# EAGLE design BBB_eagle (EAGLE 9.1.3)
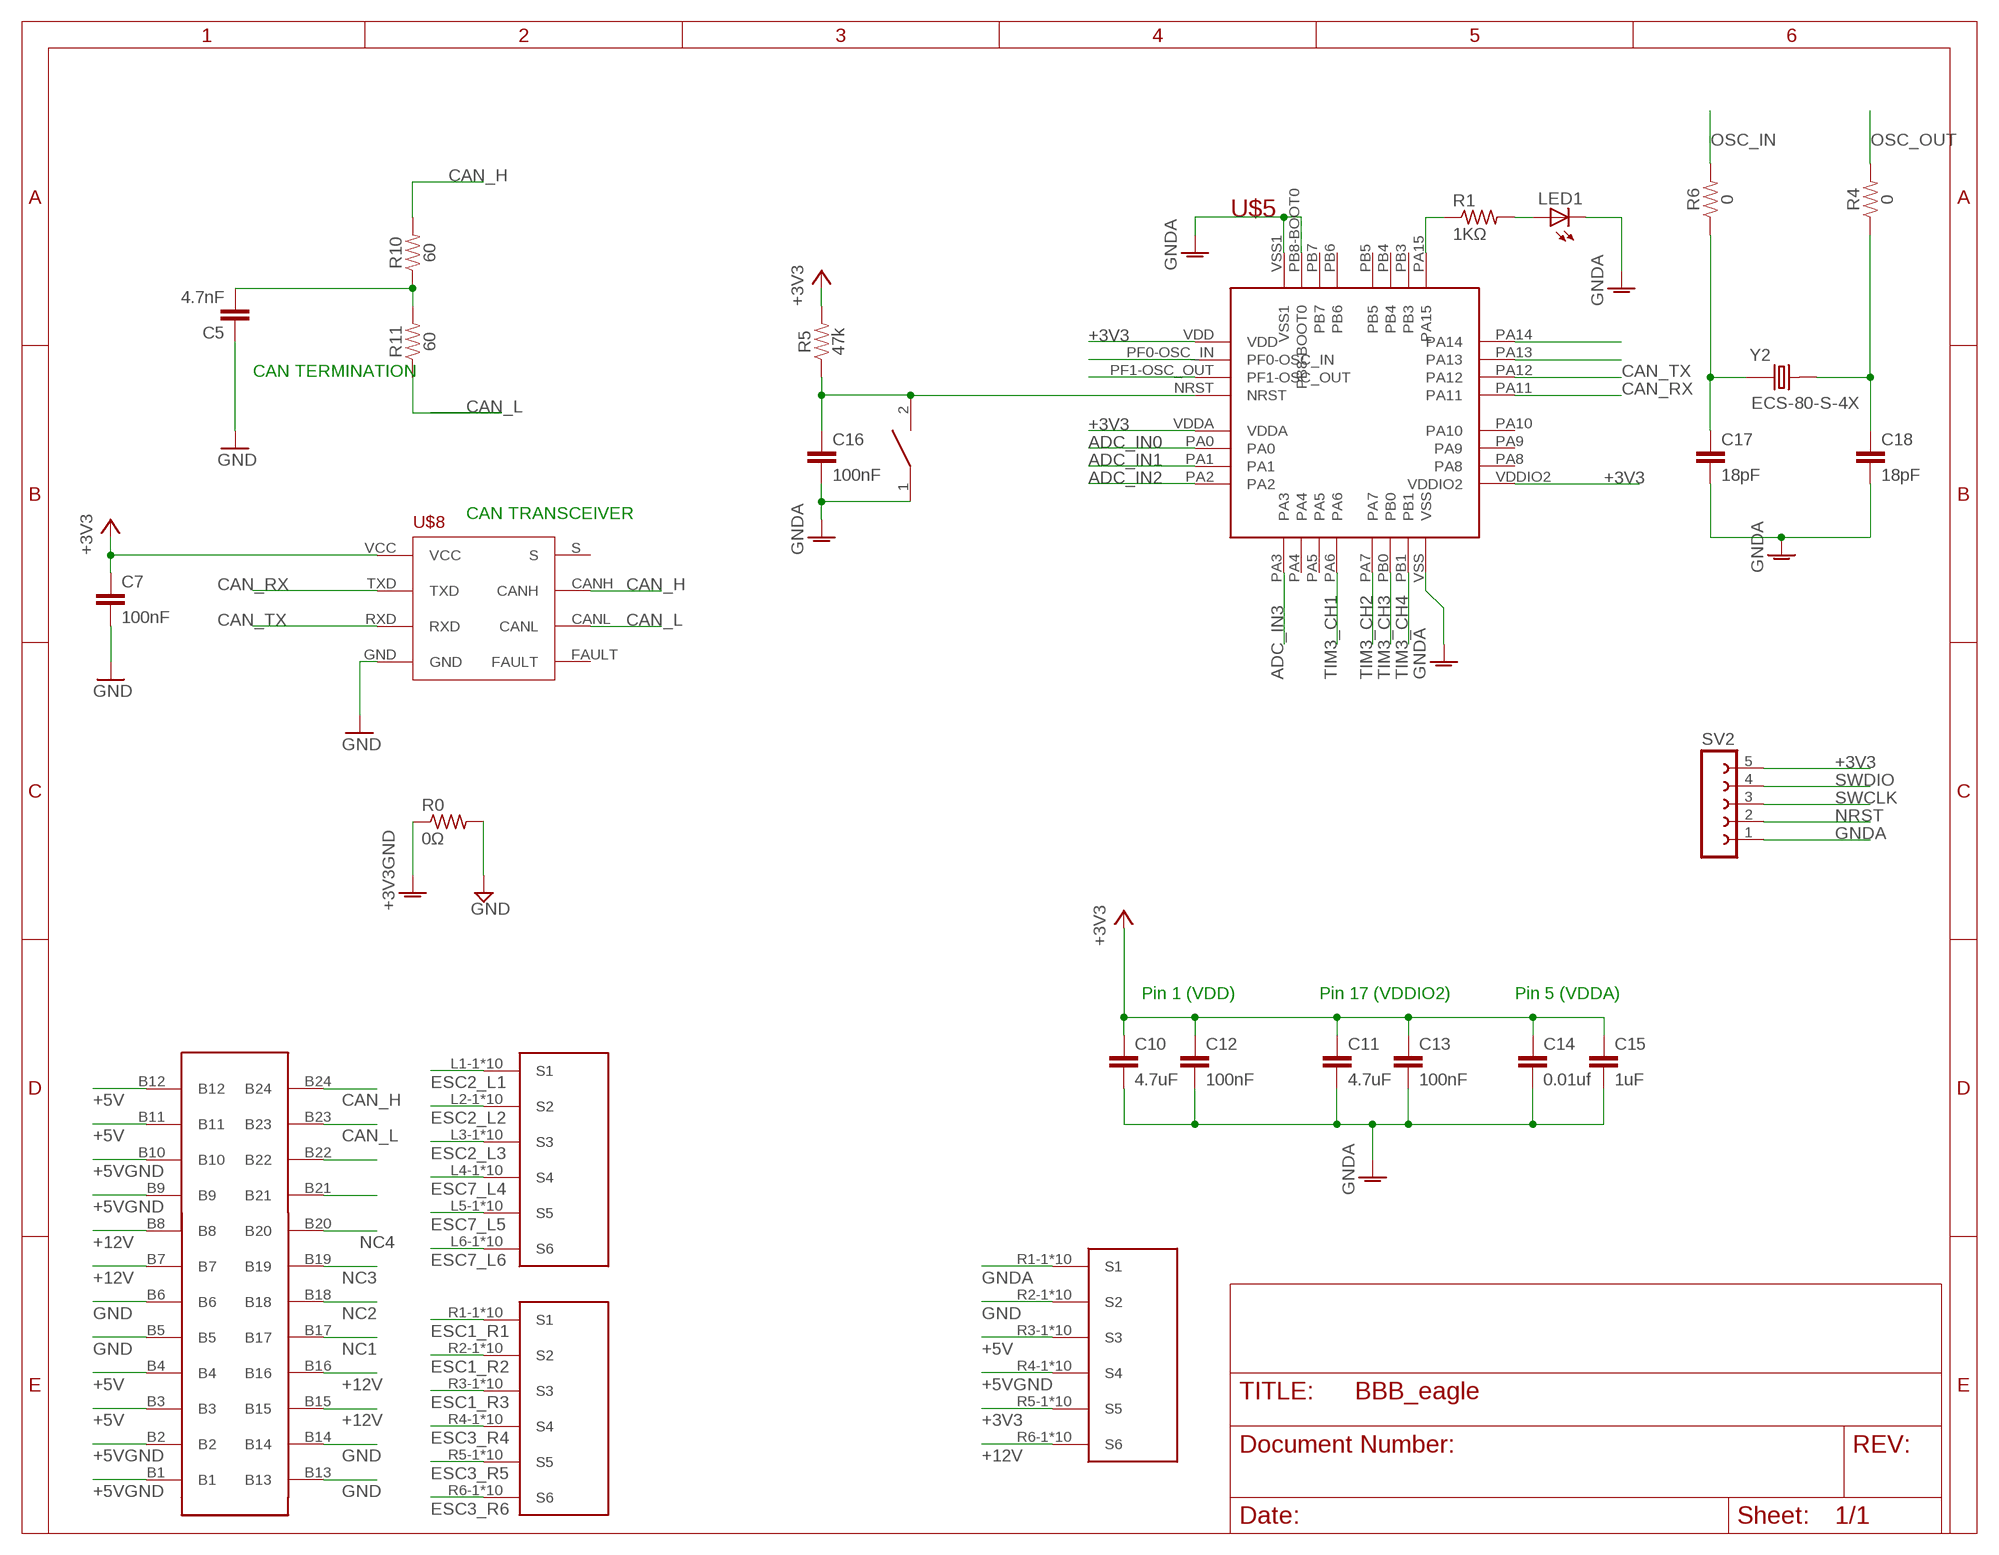
[diagram p0: schematic, sheet 1, part 1 of 2]
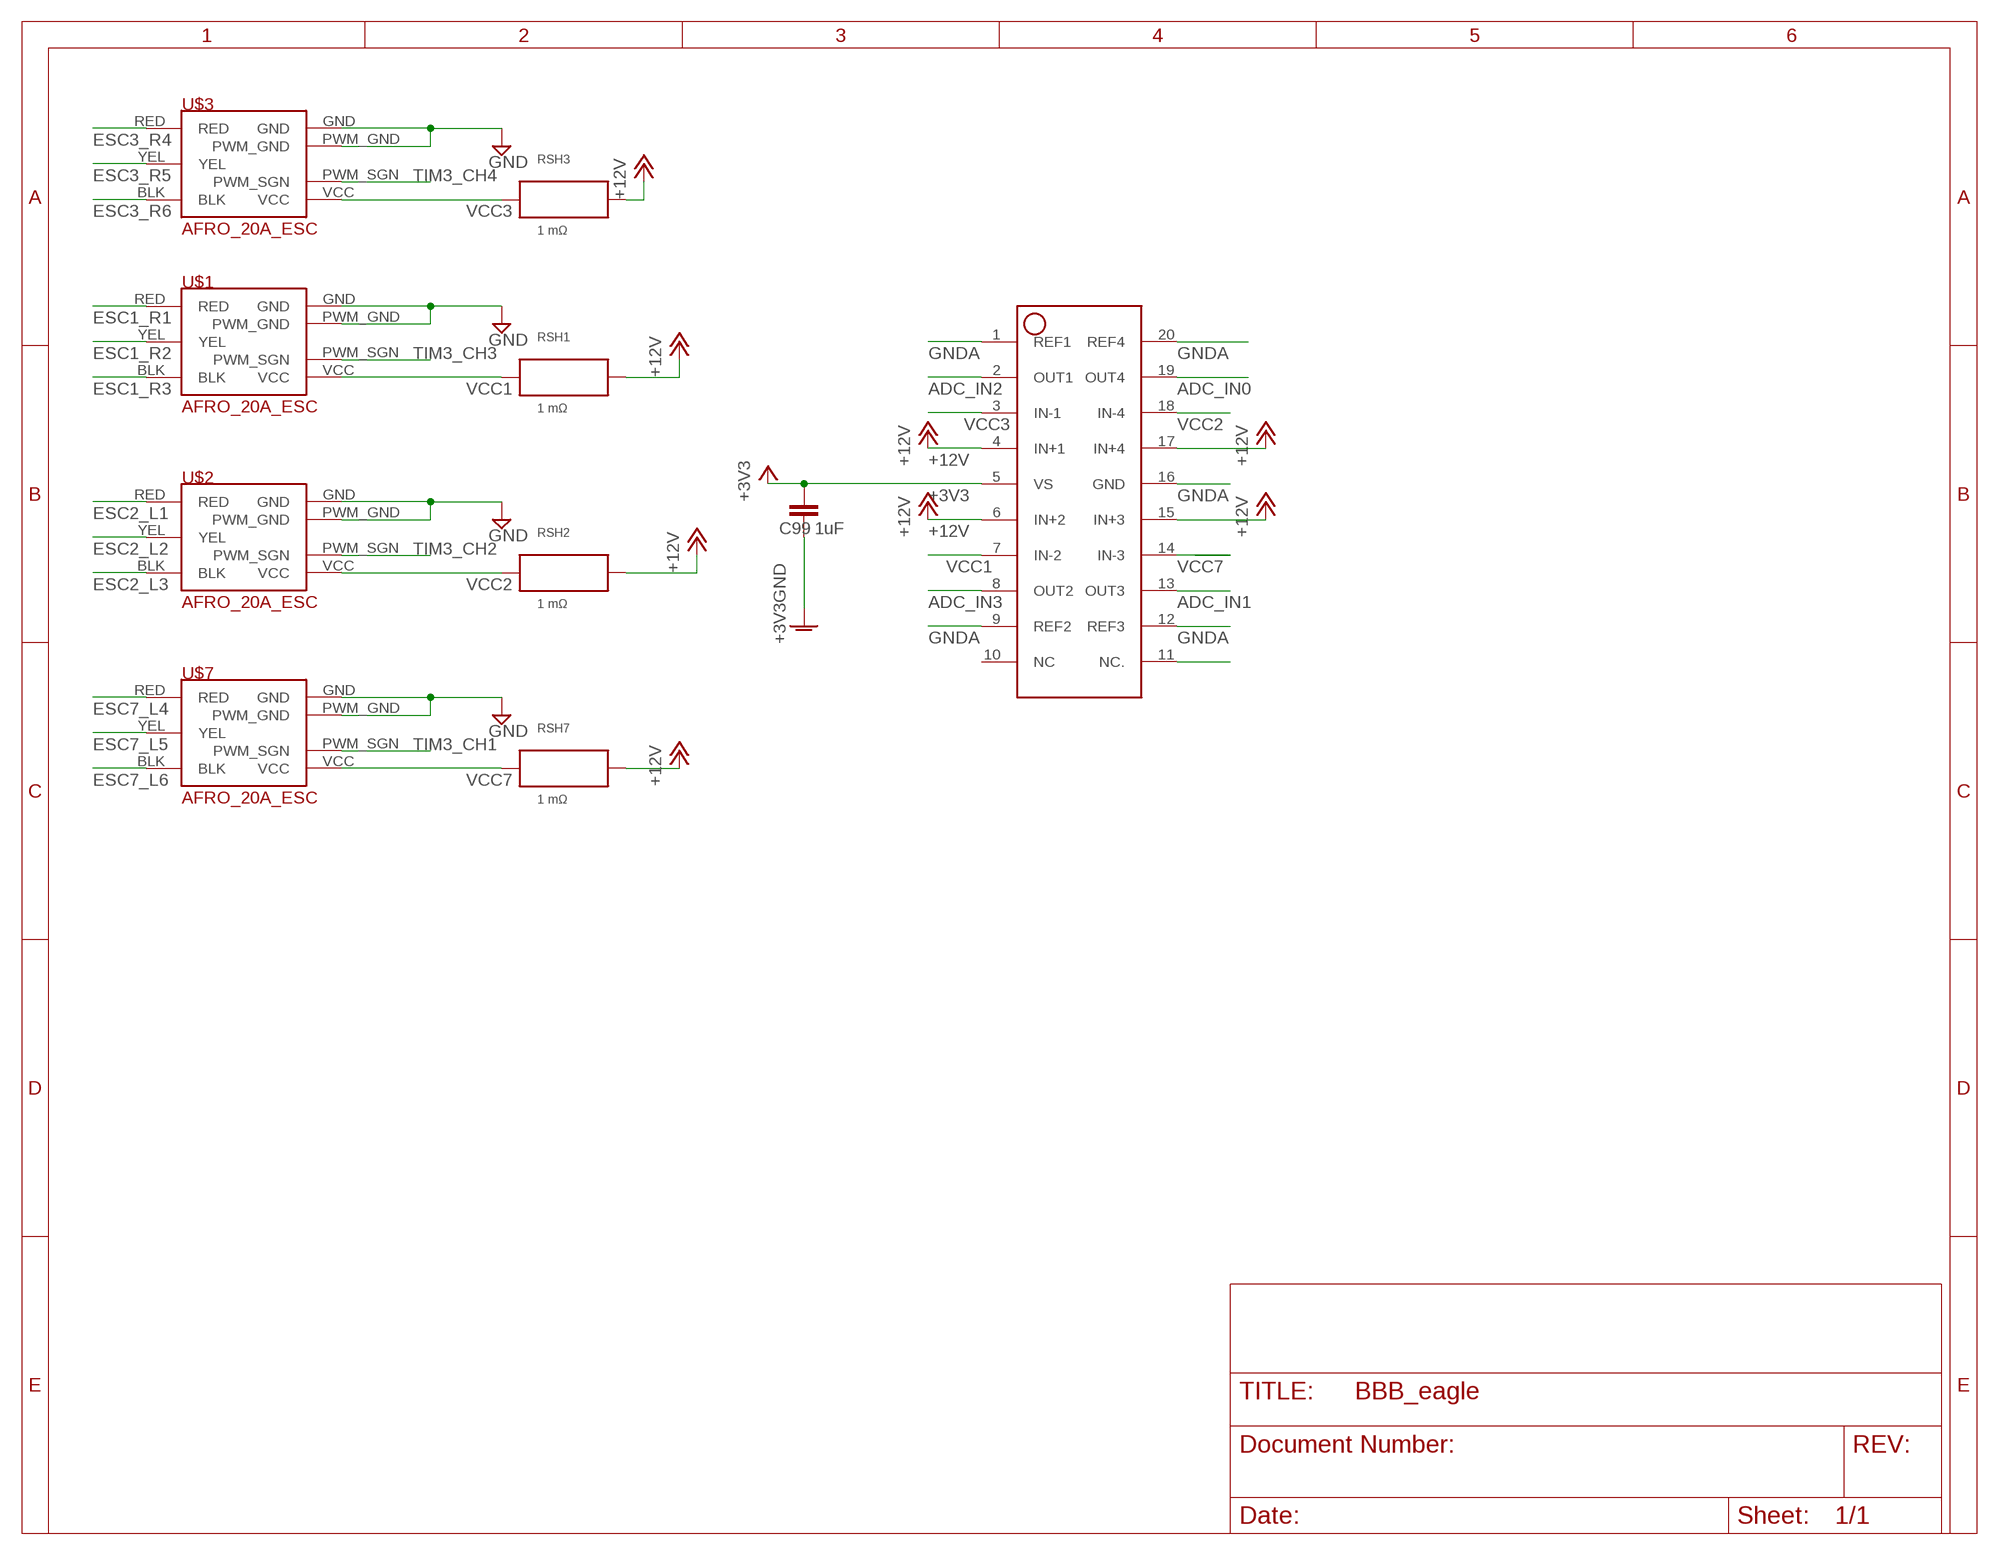
[diagram p1: schematic, sheet 1, part 2 of 2]

## Parts
C5  4.7nF  0.1UF-0603-25V-(+80/-20%)  [0603]
C7  100nF  4.7UF0603  [0603]
C10  4.7uF  4.7UF0603  [0603]
C11  4.7uF  4.7UF0603  [0603]
C12  100nF  4.7UF0603  [0603]
C13  100nF  4.7UF0603  [0603]
C14  0.01uf  4.7UF0603  [0603]
C15  1uF  4.7UF0603  [0603]
C16  100nF  4.7UF0603  [0603]
C17  18pF  4.7UF0603  [0603]
C18  18pF  4.7UF0603  [0603]
C99  1uF  4.7UF0603  [0603]
LED1  LEDCHIP-LED0805  [CHIP-LED0805]
R0  0Ω  R-US_R0603  [R0603]
R1  1KΩ  R-US_R0603  [R0603]
R4  0  1KOHM-0603-1/10W-1%  [0603]
R5  47k  1KOHM-0603-1/10W-1%  [0603]
R6  0  1KOHM-0603-1/10W-1%  [0603]
R10  60  1KOHM-0603-1/10W-1%  [0603]
R11  60  1KOHM-0603-1/10W-1%  [0603]
RESET1  SWITCH  [SW_2512]
RSH1  1 mΩ  CSS2H-2512  [CSS2H-2512]
RSH2  1 mΩ  CSS2H-2512  [CSS2H-2512]
RSH3  1 mΩ  CSS2H-2512  [CSS2H-2512]
RSH7  1 mΩ  CSS2H-2512  [CSS2H-2512]
SV2  FE05-1  [FE05-1]
U$1  AFRO_20A_ESC  [AFRO_20A_ESC]
U$2  AFRO_20A_ESC  [AFRO_20A_ESC]
U$3  AFRO_20A_ESC  [AFRO_20A_ESC]
U$4  ET60T_1  [ET60T_1]
U$5  STM32F042K6T6  [STM32F042K6T6]
U$6  ET60T_2  [ET60T_2]
U$7  AFRO_20A_ESC  [AFRO_20A_ESC]
U$8  TCAN337D  [TCAN337D]
U$14  INA4181A4  [SOP65P640X120-20]
Y2  ECS-80-S-4X  [XTAL_ECS-80-S-4X]

## Nets
+3V3: C7.1 C10.1 C11.1 C12.1 C13.1 C14.1 C15.1 C99.1 R5.2 SV2.5 U$5.VDD U$5.VDDA U$5.VDDIO2 U$6.R5-1(S5) U$6.R5-2(S5) U$6.R5-3(S5) U$6.R5-4(S5) U$6.R5-5(S5) U$6.R5-6(S5) U$6.R5-7(S5) U$6.R5-8(S5) U$6.R5-9(S5) U$6.R5-10(S5) U$8.VCC U$14.5(VS)
+5V: U$4.B3 U$4.B4 U$4.B11 U$4.B12 U$6.R3-1(S3) U$6.R3-2(S3) U$6.R3-3(S3) U$6.R3-4(S3) U$6.R3-5(S3) U$6.R3-6(S3) U$6.R3-7(S3) U$6.R3-8(S3) U$6.R3-9(S3) U$6.R3-10(S3)
+5VGND: U$4.B1 U$4.B2 U$4.B9 U$4.B10 U$6.R4-1(S4) U$6.R4-2(S4) U$6.R4-3(S4) U$6.R4-4(S4) U$6.R4-5(S4) U$6.R4-6(S4) U$6.R4-7(S4) U$6.R4-8(S4) U$6.R4-9(S4) U$6.R4-10(S4)
+12V: RSH1.2 RSH2.2 RSH3.2 RSH7.2 U$4.B7 U$4.B8 U$4.B15 U$4.B16 U$6.R6-1(S6) U$6.R6-2(S6) U$6.R6-3(S6) U$6.R6-4(S6) U$6.R6-5(S6) U$6.R6-6(S6) U$6.R6-7(S6) U$6.R6-8(S6) U$6.R6-9(S6) U$6.R6-10(S6) U$14.4(IN+1) U$14.6(IN+2) U$14.15(IN+3) U$14.17(IN+4)
ADC_IN0: U$5.PA0 U$14.19(OUT4)
ADC_IN1: U$5.PA1 U$14.13(OUT3)
ADC_IN2: U$5.PA2 U$14.2(OUT1)
ADC_IN3: U$5.PA3 U$14.8(OUT2)
CAN_H: R10.2 U$4.B24 U$8.CANH
CAN_L: R11.1 U$4.B23 U$8.CANL
CAN_RX: U$5.PA11 U$8.TXD
CAN_TX: U$5.PA12 U$8.RXD
ESC1_R1: U$1.RED U$4.R1-1(S1) U$4.R1-2(S1) U$4.R1-3(S1) U$4.R1-4(S1) U$4.R1-5(S1) U$4.R1-6(S1) U$4.R1-7(S1) U$4.R1-8(S1) U$4.R1-9(S1) U$4.R1-10(S1)
ESC1_R2: U$1.YEL U$4.R2-1(S2) U$4.R2-2(S2) U$4.R2-3(S2) U$4.R2-4(S2) U$4.R2-5(S2) U$4.R2-6(S2) U$4.R2-7(S2) U$4.R2-8(S2) U$4.R2-9(S2) U$4.R2-10(S2)
ESC1_R3: U$1.BLK U$4.R3-1(S3) U$4.R3-2(S3) U$4.R3-3(S3) U$4.R3-4(S3) U$4.R3-5(S3) U$4.R3-6(S3) U$4.R3-7(S3) U$4.R3-8(S3) U$4.R3-9(S3) U$4.R3-10(S3)
ESC2_L1: U$2.RED U$4.L1-1(S1) U$4.L1-2(S1) U$4.L1-3(S1) U$4.L1-4(S1) U$4.L1-5(S1) U$4.L1-6(S1) U$4.L1-7(S1) U$4.L1-8(S1) U$4.L1-9(S1) U$4.L1-10(S1)
ESC2_L2: U$2.YEL U$4.L2-1(S2) U$4.L2-2(S2) U$4.L2-3(S2) U$4.L2-4(S2) U$4.L2-5(S2) U$4.L2-6(S2) U$4.L2-7(S2) U$4.L2-8(S2) U$4.L2-9(S2) U$4.L2-10(S2)
ESC2_L3: U$2.BLK U$4.L3-1(S3) U$4.L3-2(S3) U$4.L3-3(S3) U$4.L3-4(S3) U$4.L3-5(S3) U$4.L3-6(S3) U$4.L3-7(S3) U$4.L3-8(S3) U$4.L3-9(S3) U$4.L3-10(S3)
ESC3_R4: U$3.RED U$4.R4-1(S4) U$4.R4-2(S4) U$4.R4-3(S4) U$4.R4-4(S4) U$4.R4-5(S4) U$4.R4-6(S4) U$4.R4-7(S4) U$4.R4-8(S4) U$4.R4-9(S4) U$4.R4-10(S4)
ESC3_R5: U$3.YEL U$4.R5-1(S5) U$4.R5-2(S5) U$4.R5-3(S5) U$4.R5-4(S5) U$4.R5-5(S5) U$4.R5-6(S5) U$4.R5-7(S5) U$4.R5-8(S5) U$4.R5-9(S5) U$4.R5-10(S5)
ESC3_R6: U$3.BLK U$4.R6-1(S6) U$4.R6-2(S6) U$4.R6-3(S6) U$4.R6-4(S6) U$4.R6-5(S6) U$4.R6-6(S6) U$4.R6-7(S6) U$4.R6-8(S6) U$4.R6-9(S6) U$4.R6-10(S6)
ESC7_L4: U$4.L4-1(S4) U$4.L4-2(S4) U$4.L4-3(S4) U$4.L4-4(S4) U$4.L4-5(S4) U$4.L4-6(S4) U$4.L4-7(S4) U$4.L4-8(S4) U$4.L4-9(S4) U$4.L4-10(S4) U$7.RED
ESC7_L5: U$4.L5-1(S5) U$4.L5-2(S5) U$4.L5-3(S5) U$4.L5-4(S5) U$4.L5-5(S5) U$4.L5-6(S5) U$4.L5-7(S5) U$4.L5-8(S5) U$4.L5-9(S5) U$4.L5-10(S5) U$7.YEL
ESC7_L6: U$4.L6-1(S6) U$4.L6-2(S6) U$4.L6-3(S6) U$4.L6-4(S6) U$4.L6-5(S6) U$4.L6-6(S6) U$4.L6-7(S6) U$4.L6-8(S6) U$4.L6-9(S6) U$4.L6-10(S6) U$7.BLK
GND: C5.1 C7.2 R0.2 U$1.GND U$1.PWM_GND U$2.GND U$2.PWM_GND U$3.GND U$3.PWM_GND U$4.B5 U$4.B6 U$4.B13 U$4.B14 U$4.B21 U$4.B22 U$6.R2-1(S2) U$6.R2-2(S2) U$6.R2-3(S2) U$6.R2-4(S2) U$6.R2-5(S2) U$6.R2-6(S2) U$6.R2-7(S2) U$6.R2-8(S2) U$6.R2-9(S2) U$6.R2-10(S2) U$7.GND U$7.PWM_GND U$8.GND
GNDA: C10.2 C11.2 C12.2 C13.2 C14.2 C15.2 C16.2 C17.2 C18.2 C99.2 LED1.C R0.1 RESET1.1 SV2.1 U$5.PB8-BOOT0 U$5.VSS U$5.VSS1 U$6.R1-1(S1) U$6.R1-2(S1) U$6.R1-3(S1) U$6.R1-4(S1) U$6.R1-5(S1) U$6.R1-6(S1) U$6.R1-7(S1) U$6.R1-8(S1) U$6.R1-9(S1) U$6.R1-10(S1) U$14.1(REF1) U$14.9(REF2) U$14.12(REF3) U$14.16(GND) U$14.20(REF4) ; supply symbol labelled +3V3GND
N$1: R1.1 U$5.PA15
N$2: LED1.A R1.2
N$3: C18.1 R4.1 Y2.2
N$4: C17.1 R6.1 Y2.1
N$5: C5.2 R10.1 R11.2
N$58: U$14.11(NC.)
NC1: U$4.B17
NC2: U$4.B18
NC3: U$4.B19
NC4: U$4.B20
NRST: C16.1 R5.1 RESET1.2 SV2.2 U$5.NRST
OSC_IN: R6.2 U$5.PF0-OSC_IN
OSC_OUT: R4.2 U$5.PF1-OSC_OUT
SWCLK: SV2.3 U$5.PA14
SWDIO: SV2.4 U$5.PA13
TIM3_CH1: U$5.PA6 U$7.PWM_SGN
TIM3_CH2: U$2.PWM_SGN U$5.PA7
TIM3_CH3: U$1.PWM_SGN U$5.PB0
TIM3_CH4: U$3.PWM_SGN U$5.PB1
VCC1: RSH1.1 U$1.VCC U$14.7(IN-2)
VCC2: RSH2.1 U$2.VCC U$14.18(IN-4)
VCC3: RSH3.1 U$3.VCC U$14.3(IN-1)
VCC7: RSH7.1 U$7.VCC U$14.14(IN-3)
Unconnected: U$5.PA4 U$5.PA5 U$5.PA8 U$5.PA9 U$5.PA10 U$5.PB3 U$5.PB4 U$5.PB5 U$5.PB6 U$5.PB7 U$8.FAULT U$8.S U$14.10(NC)

## Notes on the sheet
- CAN TERMINATION
- CAN TRANSCEIVER
- Pin 1 (VDD) | Pin 17 (VDDIO2) | Pin 5 (VDDA)

## Library data of the parts
C5 = SparkFun-Capacitors:0.1UF: 0.1µF ceramic capacitors A capacitor is a passive two-terminal electrical component used to store electrical energy temporarily in an electric field.; PROD_ID: CAP-00810; VALUE: 0.1uF
C7 C12-C18 C99 = SparkFun-Capacitors:4.7UF: 4.7µF ceramic capacitors A capacitor is a passive two-terminal electrical component used to store electrical energy temporarily in an electric field.; PROD_ID: CAP-08280; VALUE: 4.7uF
C10 C11 = SparkFun-Capacitors:4.7UF: 4.7µF ceramic capacitors A capacitor is a passive two-terminal electrical component used to store electrical energy temporarily in an electric field.; PROD_ID: CAP-08280
LED1 = led:LED: LED OSRAM: - CHIPLED LG R971, LG N971, LY N971, LG Q971, LY Q971, LO R971, LY R971 LH N974, LH R974 LS Q976, LO Q976, LY Q976 LO Q996 - Hyper CHIPLED LW Q18S LB Q993, LB Q99A, LB R99A - SideLED LS A670, LO A670, LY A670, LG A670, LP A670 LB A673, LV A673, LT A673, LW A673 LH A674 LY A675 LS A676, LA A676, LO A676, LY A676, LW A676 LS A679, LY A679, LG A679 - Hyper Micro SIDELED® LS Y876, LA Y876, LO Y876, LY Y876 LT Y87S - SmartLED LW L88C, LW L88S LB L89C, LB L89S, LG L890 LS L89K, LO L89K, LY L89K LS L896, LA L896, LO L896, LY L896 - TOPLED LS T670, LO T670, LY T670, LG T670, LP T670 LSG T670, LSP T670, LSY T670, LOP T670, LYG T670 LG T671, LOG T671, LSG T671 LB T673, LV T673, LT T673, LW T673 LH T674 LS T676, LA T676, LO T676, LY T676, LB T676, LH T676, LSB T676, LW T676 LB T67C, LV T67C, LT T67C, LS T67K, LO T67K, LY T67K, LW E67C LS E67B, LA E67B, LO E67B, LY E67B, LB E67C, LV E67C, LT E67C LW T67C LS T679, LY T679, LG T679 LS T770, LO T770, LY T770, LG T770, LP T770 LB T773, LV T773, LT T773, LW T773 LH T774 LS E675, LA E675, LY E675, LS T675 LS T776, LA T776, LO T776, LY T776, LB T776 LHGB T686 LT T68C, LB T68C - Hyper Mini TOPLED® LB M676 - Mini TOPLED Santana® LG M470 LS M47K, LO M47K, LY M47K Source: http://www.osram.convergy.de LUXEON: - LUMILED® LXK2-PW12-R00, LXK2-PW12-S00, LXK2-PW14-U00, LXK2-PW14-V00 LXK2-PM12-R00, LXK2-PM12-S00, LXK2-PM14-U00 LXK2-PE12-Q00, LXK2-PE12-R00, LXK2-PE12-S00, LXK2-PE14-T00, LXK2-PE14-U00 LXK2-PB12-K00, LXK2-PB12-L00, LXK2-PB12-M00, LXK2-PB14-N00, LXK2-PB14-P00, LXK2-PB14-Q00 LXK2-PR12-L00, LXK2-PR12-M00, LXK2-PR14-Q00, LXK2-PR14-R00 LXK2-PD12-Q00, LXK2-PD12-R00, LXK2-PD12-S00 LXK2-PH12-R00, LXK2-PH12-S00 LXK2-PL12-P00, LXK2-PL12-Q00, LXK2-PL12-R00 Source: www.luxeon.com KINGBRIGHT: KA-3528ASYC Source: www.kingbright.com
R0 R1 = rcl:R-US_: RESISTOR, American symbol; SPICEPREFIX: R
R4-R6 R10 R11 = SparkFun-Resistors:1KOHM: 1kΩ resistor A resistor is a passive two-terminal electrical component that implements electrical resistance as a circuit element. Resistors act to reduce current flow, and, at the same time, act to lower voltage levels within circuits. - Wikipedia; PROD_ID: RES-07856; VALUE: 1k
RESET1 = DiscreteComponents:SWITCH
RSH1-RSH3 RSH7 = INA4181A4:CSS2H-2512
SV2 = con-lsta:FE05-1: FEMALE HEADER; OC_FARNELL: unknown; OC_NEWARK: unknown
U$1-U$3 U$7 = afro_20A_esc:AFRO_20A_ESC
U$4 = ET60T:ET60T_1
U$5 = PI_Shield_Library:STM32F042K6T6
U$6 = ET60T:ET60T_2
U$8 = PI_Shield_Library:TCAN337D
U$14 = INA4181A4:INA4181A4
Y2 = ECS-80-S-4X:ECS-80-S-4X: CRYSTAL T/H; DESCRIPTION: Crystal 8MHz Series 2-Pin HC-49/U; DIGI-KEY_PART_NUMBER: X1057-ND; DIGI-KEY_PURCHASE_URL: https://www.digikey.com/product-detail/en/ecs-inc/ECS-80-S-4X/X1057-ND/827549?utm_source=snapeda&utm_medium=aggregator&utm_campaign=symbol; MF: ECS International; MP: ECS-80-S-4X; PACKAGE: HC-49/US ECS International

## Board
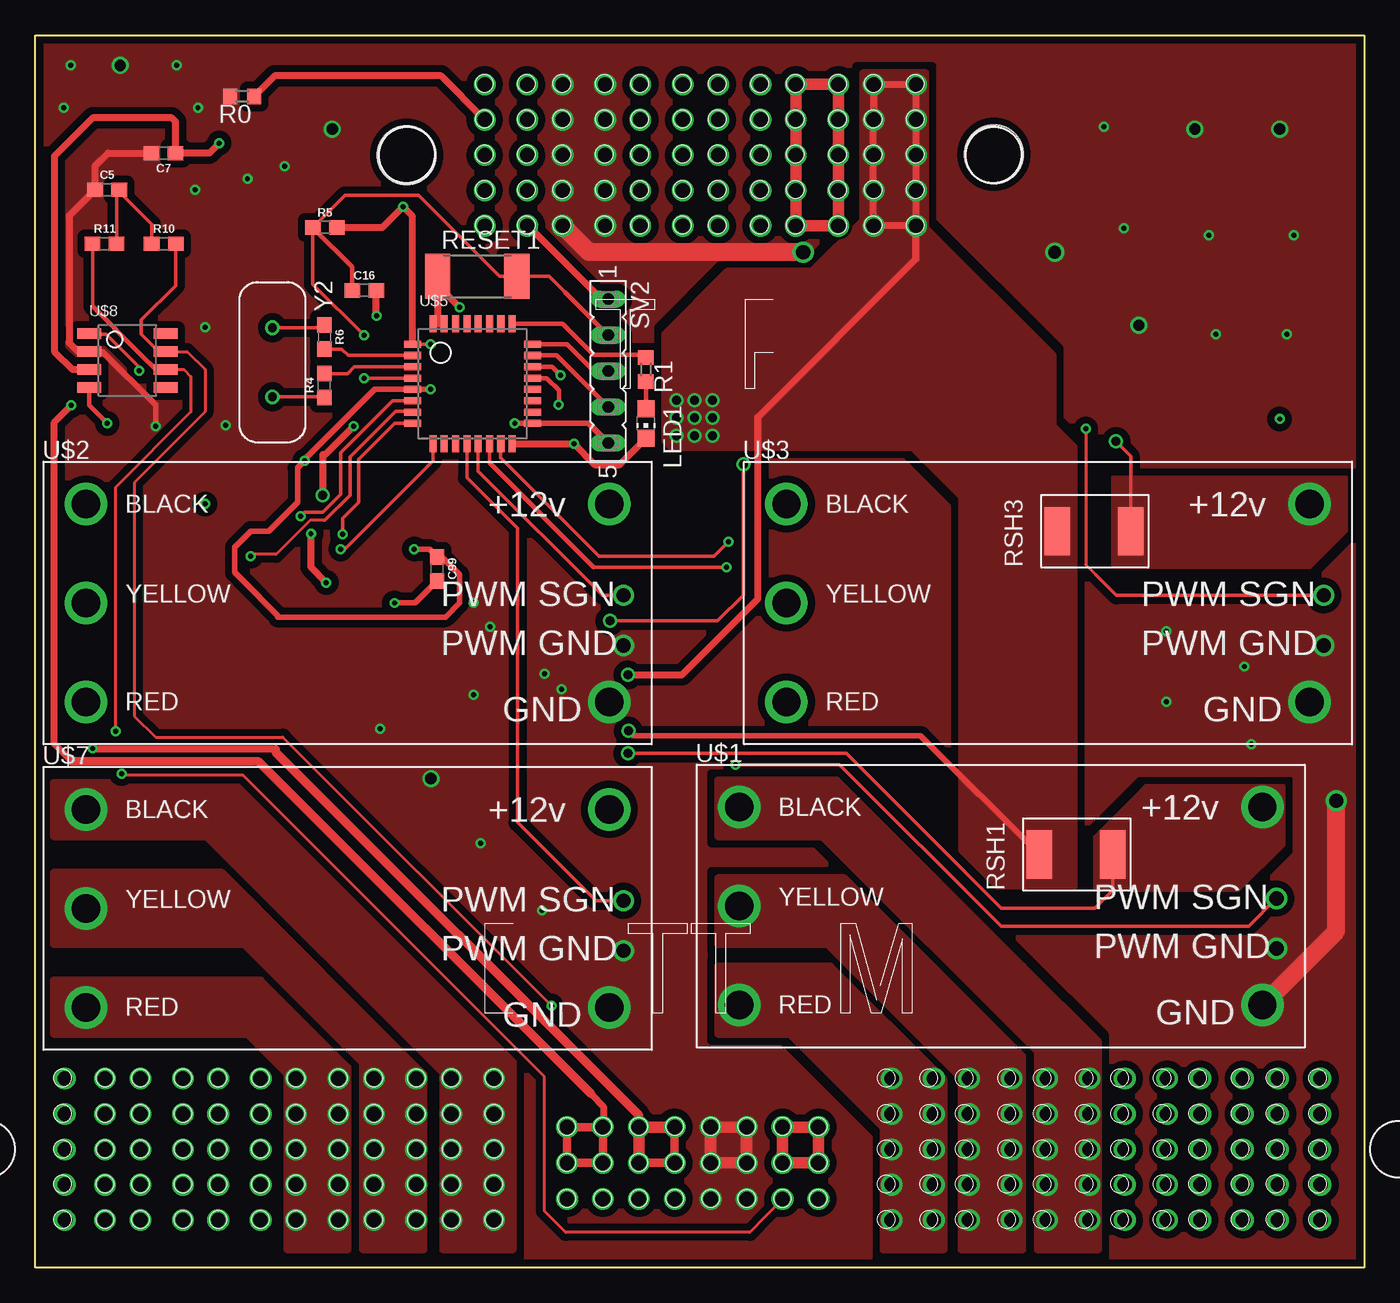
[diagram p2: board, top side]
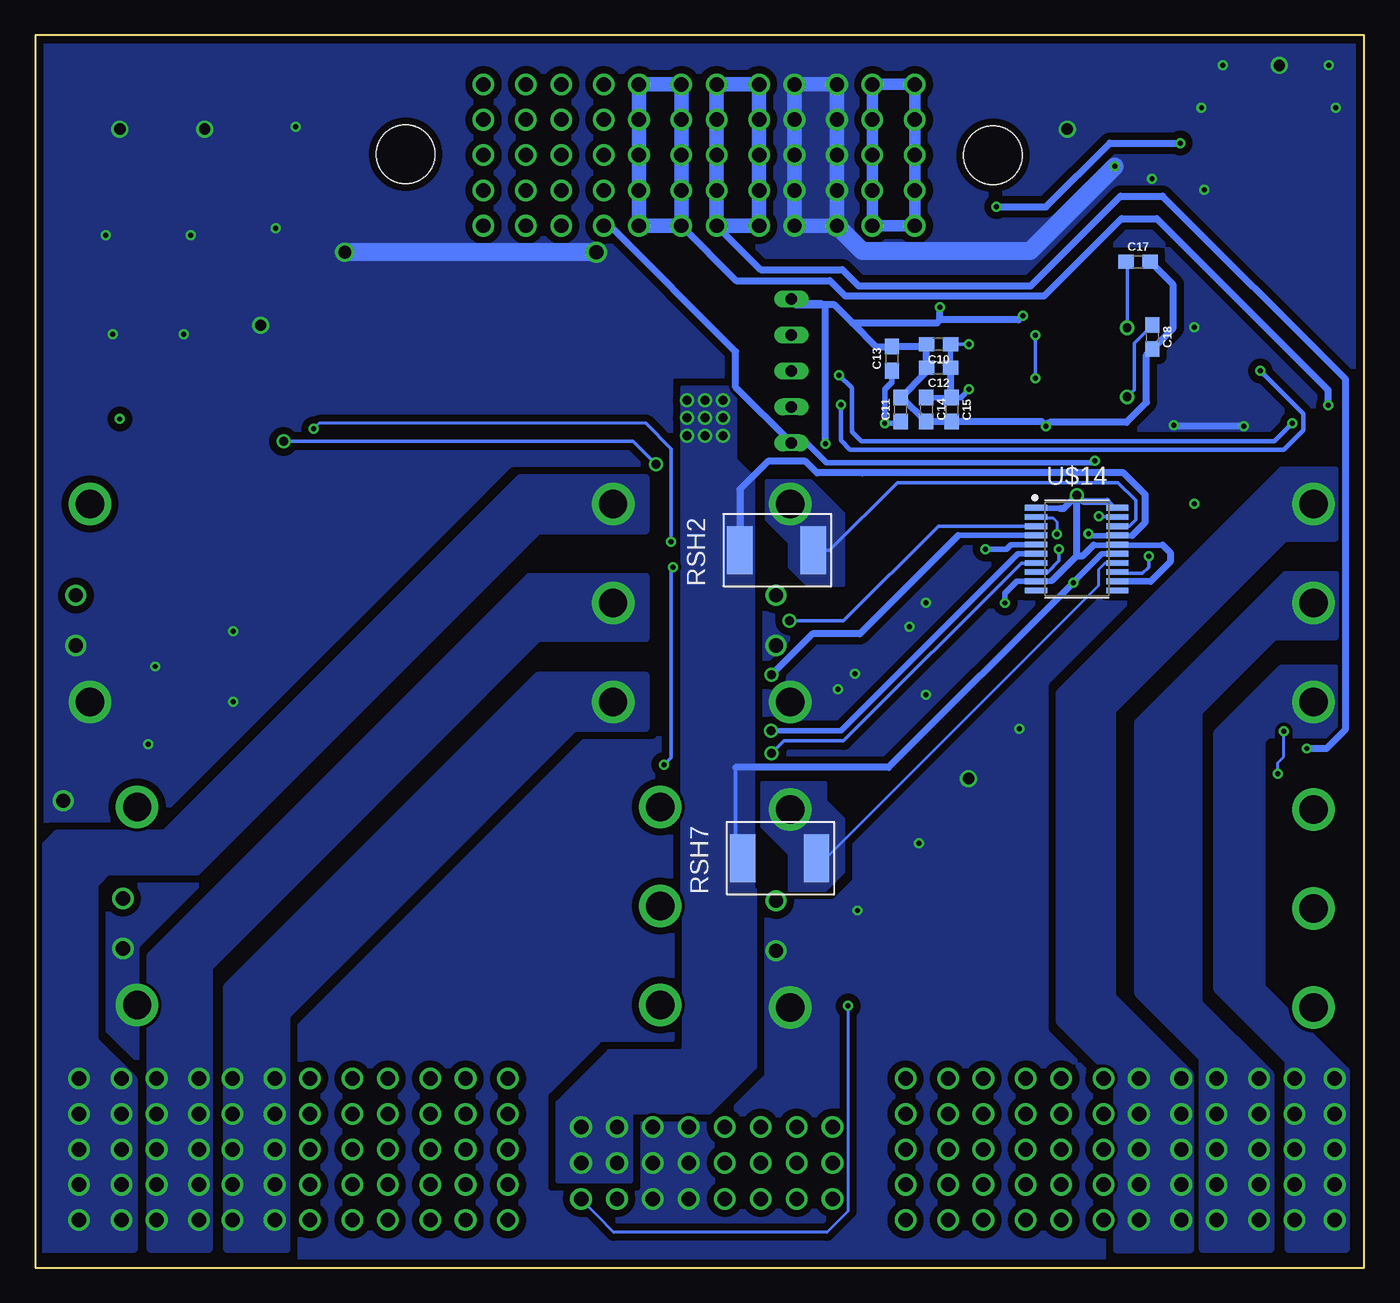
[diagram p3: board, bottom side, seen from below]

Size 93.98 x 87.12 mm. Coordinates in mm from the lower left corner, seen from the top.
Outline: 0,80 0,0
Outline: 0,0 0,87.12 93.98,87.12 93.98,0 0,0
Copper layers (1*16): Top 0.0356mm / dielectric 1.5011mm / Bottom 0.0356mm
Design rules "jason": minimum track width 8mil, minimum drill 13mil, track to track 8mil, track to pad 8mil, pad to pad 6mil, via to via 8mil, smd to smd 6mil, copper to edge 15mil, drill to drill 8mil, minimum pad ring 7mil, minimum via ring 7mil, stop-mask expansion 3mil, vias tented up to drill 0mil, thermal gap 10mil
Holes 4.14 mm at 26.25,78.65 67.8,78.72

### Footprints (pad centres in the part's own frame; a part is rotated, then mirrored left to right if it is on the bottom)
0603 = smd 1.1 x 1: 1 -0.85,0; 2 0.85,0
CHIP-LED0805 = smd 1.2 x 1.2: A 0,-1.05; C 0,1.05
R0603 = smd 1 x 1.1: 1 -0.85,0; 2 0.85,0
SW_2512 = smd 1.8 x 3.2: 1 -2.8,0; 2 2.8,0
CSS2H-2512 = smd 3.4 x 1.8: 1 0,0; 2 0,5.2
FE05-1 = drill 0.813 long: 1 -5.08,0; 2 -2.54,0; 3 0,0; 4 2.54,0; 5 5.08,0
AFRO_20A_ESC = drill 2: BLK -18,7; GND 19,-7; RED -18,-7; VCC 19,7; YEL -18,0 | drill 1: PWM_GND 20,-3; PWM_SGN 20,0.54
ET60T_1 = drill 1.02 pad 1.5: B1 -8.89,2.54; B2 -6.35,2.54; B3 -3.81,2.54; B4 -1.27,2.54; B5 1.27,2.54; B6 3.81,2.54; B7 6.35,2.54; B8 8.89,2.54; B9 -8.89,0; B10 -6.35,0; B11 -3.81,0; B12 -1.27,0; B13 1.27,0; B14 3.81,0; B15 6.35,0; B16 8.89,0; B17 -8.89,-2.54; B18 -6.35,-2.54; B19 -3.81,-2.54; B20 -1.27,-2.54; B21 1.27,-2.54; B22 3.81,-2.54; B23 6.35,-2.54; B24 8.89,-2.54; L1-1 -44.41,5.96; L1-2 -44.41,3.46; L1-3 -44.41,0.96; L1-4 -44.41,-1.54; L1-5 -44.41,-4.04; L1-6 -41.56,5.96; L1-7 -41.56,3.46; L1-8 -41.56,0.96; L1-9 -41.56,-1.54; L1-10 -41.56,-4.04; L2-1 -39.06,5.96; L2-2 -39.06,3.46; L2-3 -39.06,0.96; L2-4 -39.06,-1.54; L2-5 -39.06,-4.04; L2-6 -36.06,5.96; L2-7 -36.06,3.46; L2-8 -36.06,0.96; L2-9 -36.06,-1.54; L2-10 -36.06,-4.04; L3-1 -33.56,5.96; L3-2 -33.56,3.46; L3-3 -33.56,0.96; L3-4 -33.56,-1.54; L3-5 -33.56,-4.04; L3-6 -30.56,5.96; L3-7 -30.56,3.46; L3-8 -30.56,0.96; L3-9 -30.56,-1.54; L3-10 -30.56,-4.04; L4-1 -28.06,5.96; L4-2 -28.06,3.46; L4-3 -28.06,0.96; L4-4 -28.06,-1.54; L4-5 -28.06,-4.04; L4-6 -25.06,5.96; L4-7 -25.06,3.46; L4-8 -25.06,0.96; L4-9 -25.06,-1.54; L4-10 -25.06,-4.04; L5-1 -22.56,5.96; L5-2 -22.56,3.46; L5-3 -22.56,0.96; L5-4 -22.56,-1.54; L5-5 -22.56,-4.04; L5-6 -19.56,5.96; L5-7 -19.56,3.46; L5-8 -19.56,0.96; L5-9 -19.56,-1.54; L5-10 -19.56,-4.04; L6-1 -17.06,5.96; L6-2 -17.06,3.46; L6-3 -17.06,0.96; L6-4 -17.06,-1.54; L6-5 -17.06,-4.04; L6-6 -14.06,5.96; L6-7 -14.06,3.46; L6-8 -14.06,0.96; L6-9 -14.06,-1.54; L6-10 -14.06,-4.04; R1-1 14.06,5.96; R1-2 14.06,3.46; R1-3 14.06,0.96; R1-4 14.06,-1.54; R1-5 14.06,-4.04; R1-6 17.06,5.96; R1-7 17.06,3.46; R1-8 17.06,0.96; R1-9 17.06,-1.54; R1-10 17.06,-4.04; R2-1 19.56,5.96; R2-2 19.56,3.46; R2-3 19.56,0.96; R2-4 19.56,-1.54; R2-5 19.56,-4.04; R2-6 22.56,5.96; R2-7 22.56,3.46; R2-8 22.56,0.96; R2-9 22.56,-1.54; R2-10 22.56,-4.04; R3-1 25.06,5.96; R3-2 25.06,3.46; R3-3 25.06,0.96; R3-4 25.06,-1.54; R3-5 25.06,-4.04; R3-6 28.06,5.96; R3-7 28.06,3.46; R3-8 28.06,0.96; R3-9 28.06,-1.54; R3-10 28.06,-4.04; R4-1 30.56,5.96; R4-2 30.56,3.46; R4-3 30.56,0.96; R4-4 30.56,-1.54; R4-5 30.56,-4.04; R4-6 33.56,5.96; R4-7 33.56,3.46; R4-8 33.56,0.96; R4-9 33.56,-1.54; R4-10 33.56,-4.04; R5-1 35.91,5.96; R5-2 35.91,3.46; R5-3 35.91,0.96; R5-4 35.91,-1.54; R5-5 35.91,-4.04; R5-6 38.91,5.96; R5-7 38.91,3.46; R5-8 38.91,0.96; R5-9 38.91,-1.54; R5-10 38.91,-4.04; R6-1 41.41,5.96; R6-2 41.41,3.46; R6-3 41.41,0.96; R6-4 41.41,-1.54; R6-5 41.41,-4.04; R6-6 44.41,5.96; R6-7 44.41,3.46; R6-8 44.41,0.96; R6-9 44.41,-1.54; R6-10 44.41,-4.04
STM32F042K6T6 = smd 1.2 x 0.5: NRST 0,3.2; PA0 0,1.6; PA1 0,0.8; PA2 0,0; PA8 8.5,0.8; PA9 8.5,1.6; PA10 8.5,2.4; PA11 8.5,3.2; PA12 8.5,4; PA13 8.5,4.8; PA14 8.5,5.6; PF0-OSC_IN 0,4.8; PF1-OSC_OUT 0,4; VDD 0,5.6; VDDA 0,2.4; VDDIO2 8.5,0 | smd 0.5 x 1.2: PA3 1.45,-1.45; PA4 2.25,-1.45; PA5 3.05,-1.45; PA6 3.85,-1.45; PA7 4.65,-1.45; PA15 7.05,7.05; PB0 5.45,-1.45; PB1 6.25,-1.45; PB3 6.25,7.05; PB4 5.45,7.05; PB5 4.65,7.05; PB6 3.85,7.05; PB7 3.05,7.05; PB8-BOOT0 2.25,7.05; VSS 7.05,-1.45; VSS1 1.45,7.05
ET60T_2 = drill 1.02 pad 1.5: R1-1 -15.25,5; R1-2 -15.25,2.5; R1-3 -15.25,0; R1-4 -15.25,-2.5; R1-5 -15.25,-5; R1-6 -12.25,5; R1-7 -12.25,2.5; R1-8 -12.25,0; R1-9 -12.25,-2.5; R1-10 -12.25,-5; R2-1 -9.75,5; R2-2 -9.75,2.5; R2-3 -9.75,0; R2-4 -9.75,-2.5; R2-5 -9.75,-5; R2-6 -6.75,5; R2-7 -6.75,2.5; R2-8 -6.75,0; R2-9 -6.75,-2.5; R2-10 -6.75,-5; R3-1 -4.25,5; R3-2 -4.25,2.5; R3-3 -4.25,0; R3-4 -4.25,-2.5; R3-5 -4.25,-5; R3-6 -1.25,5; R3-7 -1.25,2.5; R3-8 -1.25,0; R3-9 -1.25,-2.5; R3-10 -1.25,-5; R4-1 1.25,5; R4-2 1.25,2.5; R4-3 1.25,0; R4-4 1.25,-2.5; R4-5 1.25,-5; R4-6 4.25,5; R4-7 4.25,2.5; R4-8 4.25,0; R4-9 4.25,-2.5; R4-10 4.25,-5; R5-1 6.75,5; R5-2 6.75,2.5; R5-3 6.75,0; R5-4 6.75,-2.5; R5-5 6.75,-5; R5-6 9.75,5; R5-7 9.75,2.5; R5-8 9.75,0; R5-9 9.75,-2.5; R5-10 9.75,-5; R6-1 12.25,5; R6-2 12.25,2.5; R6-3 12.25,0; R6-4 12.25,-2.5; R6-5 12.25,-5; R6-6 15.25,5; R6-7 15.25,2.5; R6-8 15.25,0; R6-9 15.25,-2.5; R6-10 15.25,-5
TCAN337D = smd 1.7 x 0.75: CANH 5.4,2.54; CANL 5.4,1.27; FAULT 5.4,0; GND 0,2.54; RXD 0,0; S 5.4,3.81; TXD 0,3.81; VCC 0,1.27
SOP65P640X120-20 = smd 1.572 x 0.407: 1 -2.872,2.925; 2 -2.872,2.275; 3 -2.872,1.625; 4 -2.872,0.975; 5 -2.872,0.325; 6 -2.872,-0.325; 7 -2.872,-0.975; 8 -2.872,-1.625; 9 -2.872,-2.275; 10 -2.872,-2.925; 11 2.872,-2.925; 12 2.872,-2.275; 13 2.872,-1.625; 14 2.872,-0.975; 15 2.872,-0.325; 16 2.872,0.325; 17 2.872,0.975; 18 2.872,1.625; 19 2.872,2.275; 20 2.872,2.925
XTAL_ECS-80-S-4X = drill 0.63 pad 1.03: 1 -2.44,0; 2 2.44,0

### Placement (x,y rotation side)
C5  5.08,76.2 0 top
C7  9.07,78.8 180 top
C10  30.1,65.28 180 bottom
C11  32.78,60.66 90 bottom
C12  30.1,63.63 180 bottom
C13  33.4,64.26 90 bottom
C14  30.98,60.66 270 bottom
C15  29.17,60.66 270 bottom
C16  23.26,69.09 0 top
C17  15.99,71.12 0 bottom
C18  14.99,65.79 270 bottom
C99  28.42,49.4 270 top
LED1  43.18,59.69 180 top
R0  14.63,82.81 180 top
R1  43.18,63.5 270 top
R4  20.45,62.36 90 top
R5  20.48,73.53 0 top
R6  20.45,65.79 270 top
R10  9.08,72.39 0 top
R11  4.89,72.39 0 top
RESET1  31.25,70.1 0 top
RSH1  76.2,29.21 90 top
RSH2  38.96,50.73 90 bottom
RSH3  77.47,52.07 90 top
RSH7  38.73,28.96 90 bottom
SV2  40.51,63.39 270 top
U$1  67.78,25.56 0 top
U$2  21.59,46.99 0 top
U$3  71.12,46.99 0 top
U$4  46.49,7.4 0 top
U$5  26.67,59.69 0 top
U$6  47.04,78.66 0 top
U$7  21.59,25.4 0 top
U$8  3.81,62.23 0 top
U$14  20.32,50.8 0 bottom
Y2  16.76,64.01 270 top

### Tracks (layer width: path | path; a pad name or v marks a point on that pad's centre or on a via)
+3V3  (via drill 0.35)
  Top 0.254: v27.94,65.28 27.93,65.29 U$5.VDD | 27.93,62.09 v27.94,62.1
  Top 0.381: U$5.VDDA 23.99,62.09 19.05,57.15 v19.05,57.05 18.55,56.55 18.55,54.11 16.51,52.07 15.24,52.07 14.1,50.93 14.1,49.15 14.62,48.62 17.14,46.1 17.14,45.97 26.92,45.97 | C99.1 27.87,50.8
  Top 0.406: U$5.VDDA 27.93,62.09 | v33.91,59.69 U$5.VDDIO2 39.12,59.69 SV2.5 | 26.92,45.97 26.95,46 29,46 30,47 30,49 28.75,50.25 C99.1 | 27.87,50.8 v26.8,50.8
  Top 0.5: 26.67,72.39 26.67,74.33 v26,75 24.53,73.53 R5.2 | v13,79.5 12.3,78.8 C7.1
  Top 0.508: C7.1 9.92,81.02 9.66,81.28 4.04,81.28 1.35,78.59 1.35,64.77 2.62,63.5 U$8.VCC | U$5.VDD 26.67,72.39
  Top 0.813: U$6.R5-1 U$6.R5-2 U$6.R5-3 U$6.R5-4 U$6.R5-5 U$6.R5-10 U$6.R5-9 U$6.R5-8 U$6.R5-7 U$6.R5-6 U$6.R5-1
  Bottom 0.254: C10.1 v27.94,65.28 | C11.1 32.9,59.69
  Bottom 0.406: C10.1 C12.1 | v27.94,62.1 28.54,61.51 C15.1 C14.1 | C13.1 33.4,62.61 33.91,62.1 v33.91,59.69 32.9,59.69 | SV2.5 39.43,58.31 38.04,56.92 32,56.92 19.18,56.92 v19.05,57.05 | U$14.5 24.99,51.12 25.32,50.8 v26.8,50.8
  Bottom 0.5: v26,75 22.5,75 18,79.5 v13,79.5
  Bottom 0.508: C12.1 29.25,61.58 C15.1 | SV2.5 44.45,62.25 44.45,64.77 53.34,73.66 U$6.R5-5
+5V  (via drill 0.35)
  Top 0.508: 17,36.65 4.12,36.65 v4.06,36.7
  Top 0.61: U$4.B11 U$4.B12 U$4.B4 | U$4.B3 42.68,10.77 17,36.45 17,36.65
  Top 0.813: U$4.B11 U$4.B3 U$4.B4
  Bottom 0.5: 1.35,38.02 2.67,36.7 v4.06,36.7
  Bottom 0.508: 1.35,38.02 1.35,62.85 14.26,75.76 17.24,75.76 23.58,69.42 35.76,69.42 36.9,70.56 42.69,70.56 U$6.R3-10
  Bottom 1.016: U$6.R3-5 U$6.R3-10 U$6.R3-9 U$6.R3-8 U$6.R3-7 U$6.R3-6 U$6.R3-1 U$6.R3-2 U$6.R3-3 U$6.R3-4 U$6.R3-5
+5VGND  (via drill 0.35)
  Top 0.5: 40.18,11.39 U$4.B2
  Top 0.508: 2.54,35.81 2.54,35.84 1.35,37.04 1.35,59.77 v2.54,60.96 | 39.28,12.29 40.18,11.39
  Top 0.61: 39.28,12.29 15.76,35.81 2.54,35.81 | U$4.B2 U$4.B10 U$4.B9 U$4.B1 U$4.B2
  Bottom 0.508: v2.54,60.96 2.54,62.04 14.67,74.17 17.17,74.17 22.63,68.71 36.71,68.71 37.79,69.79 44.42,69.79 | U$6.R4-5 44.42,69.79 | 44.42,69.79
  Bottom 1.016: U$6.R4-5 U$6.R4-10 U$6.R4-9 U$6.R4-8 U$6.R4-7 U$6.R4-6 U$6.R4-1 U$6.R4-2 U$6.R4-3 U$6.R4-4 U$6.R4-5
+12V  (via drill 0.35, 0.64)
  Top 0.406: RSH1.2 62.61,37.6 42.29,37.6 v41.95,37.95
  Top 0.5: v20.57,48.44 19.49,49.52 v19.49,51.88
  Top 0.508: v41.91,41.91 45.72,41.91 51.1,47.29 51.1,60.12 62.29,71.32 U$6.R6-10 | U$6.R6-10 U$6.R6-5 U$6.R6-4 U$6.R6-3 U$6.R6-2 U$6.R6-1 U$6.R6-6 U$6.R6-7 U$6.R6-8 U$6.R6-9 U$6.R6-10
  Top 0.813: U$4.B7 U$4.B15 U$4.B16 U$4.B8 U$4.B7
  Bottom 0.254: 17.46,50.46 U$14.15 | 44.45,35.37 44.45,29.47 RSH7.2 | U$14.6 | U$14.17 17.43,51.76
  Bottom 0.406: 16.42,51.76 17.43,51.76 19.37,51.76 | U$14.6 24.48,50.47 37.01,37.95 v41.95,37.95 | U$14.4 28.7,51.77 | 20.57,48.45 18.56,50.46 17.46,50.46
  Bottom 0.5: 16.42,51.76 15.48,52.7 15.48,54.65 17.02,56.2 35.5,56.2 | 44.45,35.37 33.64,35.37 v20.57,48.44 20.57,48.45 | 43.18,56 42.18,57 39.5,57 38.7,56.2 | v19.49,51.88 19.37,51.76
  Bottom 0.508: 28.7,51.77 35.66,44.81 39.01,44.81 v41.91,41.91 | 35.5,56.2 38.7,56.2 | 43.18,56 44.16,55.02 RSH2.2
  other vias: 45.34,61.34 46.61,61.34 47.88,61.34 47.88,60.07 46.61,60.07 45.34,60.07 45.34,58.8 46.61,58.8 47.88,58.8
  pour Bottom (no thermals): 44.45,62.23 48.26,62.23 48.26,25.4 43.18,25.4 43.18,55.88 44.45,57.15
  pour Bottom (no thermals): 56.95,6.18 56.95,11.63 53.34,15.24 52.07,15.24 48.26,15.24 47.99,15.51 47.99,26.67 43.18,26.67 43.18,16.51 43.18,14.2 46.34,11.04 51.94,11.04 51.94,6.18
  pour Top (no thermals): 58.5,84.47 58.5,74.02 54.9,70.43 52.93,70.43 48.93,70.43 44.5,66 44.5,58.5 45,58 48.5,58 62,58 65.5,54.5 65.5,29.5 68,27 73.5,27 73.5,58 72,59.5 72,64.5 63,73.5 63,84.47
ADC_IN0  (via drill 0.35)
  Top 0.254: v18.77,53.14 19.03,53.4 20.3,53.4 21.59,54.69 21.59,57.62 25.26,61.29 U$5.PA0
  Bottom 0.254: U$14.19 18.7,53.08 v18.77,53.14
ADC_IN1  (via drill 0.35)
  Top 0.203: 15.36,50.42 17.02,50.42 19.43,52.83 20.46,52.83
  Top 0.254: 15.36,50.42 v15.24,50.3 | 20.46,52.83 22.25,54.62 22.25,57.32 25.47,60.54 26.62,60.54 U$5.PA1
  Bottom 0.254: v15.24,50.3 15.24,49.53 15.67,49.1 17.37,49.1 U$14.13
ADC_IN2  (via drill 0.35)
  Top 0.254: U$5.PA2 25.4,59.69 24.13,58.42 | 24.13,58.42 | 24.13,58.42 22.86,57.15 22.86,54.11 21.73,52.98 v21.73,51.86
  Bottom 0.203: U$14.2 23.12,53 22,53 21.73,52.73 v21.73,51.86
ADC_IN3  (via drill 0.35)
  Top 0.254: U$5.PA3 28.12,57.04 21.88,50.8 v21.59,50.8
  Bottom 0.254: v21.59,50.8 21.59,49.97 22.38,49.17 U$14.8
CAN_H  (via drill 0.35)
  Top 0.203: U$8.CANH 10.73,64.77 12,63.5 12,60.5 7,55.5 7,39 8.5,37.5 17.5,37.5 v36.5,18.5
  Top 0.254: U$8.CANH 8.73,64.77 7.5,66 7.5,67 9.93,69.43 R10.2
  Bottom 0.203: U$4.B24 53.08,2.5 38,2.5 36.5,4 36.5,17 v36.5,18.5
CAN_L  (via drill 0.35)
  Top 0.203: 8.5,63.5 U$8.CANL 10.5,63.5 11,63 11,60.5 5.68,55.18 v5.68,37.93 | U$4.B23 50.53,2.5 37.5,2.5 36,4 36,13.5 14.7,34.8 6.1,34.8 v6.1,34.92
  Top 0.254: 4.04,67.96 R11.1
  Top 0.305: 8.5,63.5 7.5,64.5 4.04,67.96
  Bottom 0.203: v6.1,34.92 6.1,35.71 5.68,36.12 v5.68,37.93
CAN_RX  (via drill 0.35)
  Top 0.254: U$8.TXD 3.85,66 5,66 7.34,63.66 v7.34,63.4
  Top 0.305: U$5.PA11 36.17,62.89 37.04,62.02 37.04,61.04 v37,61
  Bottom 0.305: v7.34,63.4 4.31,60.36 4.31,59.19 5.67,57.83 36.35,57.83 37.01,58.49 37.01,60.99 v37,61
CAN_TX  (via drill 0.35)
  Top 0.305: U$5.PA12 36.55,63.69 v37.13,63.1 | v5.08,59.69 3.81,60.96 U$8.RXD
  Bottom 0.305: 35.57,58.43 36.22,59.08 36.22,62.19 v37.13,63.1 | 35.57,58.43 35.56,58.42 | v5.08,59.69 6.35,58.42 35.56,58.42 | 35.56,58.42 35.57,58.43
ESC1_R1
  pour Top (no thermals): 48.26,21.32 48.26,16.51 52.07,16.51 53.34,16.51 59.94,9.91 59.94,1.27 64.29,1.27 64.29,13.27 56.24,21.32
ESC1_R2
  pour Top (no thermals): 48.26,27.56 48.26,26.67 48.26,22.86 55.98,22.86 65.44,13.39 65.44,1.27 69.85,1.27 69.85,14.93 57.22,27.56
ESC1_R3
  pour Top (no thermals): 48.26,34.46 48.26,30.48 55.62,30.48 70.85,15.25 70.85,13.21 70.85,1.27 75.2,1.27 75.2,15.97 69.85,21.32 56.71,34.46
ESC2_L1
  pour Bottom (isolate 0.254, no thermals): 2.04,40.64 2.04,37.63 6.82,37.63 7.24,37.21 7.24,19.9 3.85,16.51 1.31,13.97 1.27,13.97 1.27,1.27 5.35,1.27 5.35,14.59 10.41,19.65 10.41,37.85 5.85,42.41 2.04,42.41
ESC2_L2
  pour Bottom (no thermals): 6.62,1.27 11.43,1.27 11.43,14.76 16,19.34 16,38.61 5.57,49.04 2.04,49.04 2.04,44.59 6.34,44.59 11.7,39.23 11.7,35.56 11.7,18.78 6.62,13.7
ESC2_L3
  pour Bottom (no thermals): 12.27,1.27 12.27,13.67 17.78,19.18 17.78,39.37 16.51,40.64 5.58,51.57 3.81,51.57 2.04,51.57 2.04,56.38 5.85,56.38 21.59,40.64 21.59,38.1 21.59,17.4 17.53,13.34 17.53,1.27
ESC3_R4
  pour Bottom (no thermals): 50.8,41.91 50.8,38.1 55.88,38.1 76.2,17.78 76.2,6.35 76.2,1.27 80.43,1.27 80.43,19.9 58.42,41.91
ESC3_R5
  pour Bottom (no thermals): 50.8,48.9 50.8,44.45 58.42,44.45 81.7,21.17 81.7,16.93 81.7,1.27 85.85,1.27 85.85,15.75 85.85,22.1 59.05,48.9
ESC3_R6
  pour Bottom (no thermals): 50.8,55.88 50.8,52.07 58.42,52.07 82.55,27.94 87.63,27.94 88.9,27.94 89.79,27.05 89.79,16.13 87.01,13.35 87.01,12.08 87.01,1.27 93.47,1.27 93.47,29.72 92.71,30.48 92.46,30.73 84.84,30.73 59.69,55.88
ESC7_L4
  pour Top (isolate 0.254, no thermals): 1.27,20.32 1.27,16.51 11.43,16.51 14.97,16.51 17.78,13.7 17.78,1.27 22.13,1.27 22.13,14.13 15.94,20.32
ESC7_L5
  pour Top (no thermals): 1.27,27.94 1.27,22.86 12.7,22.86 14.73,22.86 23.12,14.47 23.12,1.27 27.5,1.27 27.5,13.65 13.21,27.94
ESC7_L6
  pour Top (isolate 0.508, no thermals): 1.27,34.29 1.27,30.48 12.09,30.48 28.79,13.78 28.79,1.27 33.82,1.27 33.82,14.57 14.1,34.29
GND  (via drill 0.35, 0.8 pad 1.15, 0.9 pad 1.2, 1 pad 1.3)
  Top 0.406: U$8.GND 4.73,64.77 8.5,61 v8.5,59.5
  Top 0.508: U$8.GND 3.02,64.77 2.39,65.41 2.39,74.36 C5.1 4.23,77.89 5.14,78.8 C7.2
  Top 0.813: U$4.B14 U$4.B13 U$4.B5 U$4.B6 U$4.B14
  Top 1.27: U$1.GND 92,23.78 v92,33 | U$6.R2-5 39.14,71.81 54.29,71.81 v54.31,71.79
  Bottom 0.508: v8.5,59.5 13.4,59.5 v13.46,59.56
  Bottom 1.016: U$6.R2-5 U$6.R2-4 U$6.R2-3 U$6.R2-2 U$6.R2-1 U$6.R2-6 U$6.R2-7 U$6.R2-8 U$6.R2-9 U$6.R2-10 U$6.R2-5
  Bottom 1.27: U$6.R2-5 35.51,71.88 23.62,71.88 v17.64,77.86 | v54.31,71.79 v72.09,71.79
  other vias: 12,66.5 31,40.5 21,80.5 6,85 11.3,76.2 10,85 77,73.5 83.5,66 78.05,66.62 82,80.5 83,73 85.5,42.5 88,80.5 27.98,34.58 35.84,25.25 31.5,30 88.5,66 24.39,38.11 2.5,85 11.5,82 80,45 80,40 86,37 32.15,45.32 37.21,40.89 2,82 15,77 89,73 75.56,80.64 36,42 31,47
  pour Top (isolate 0.508, rank 2, no thermals): -0.81,87.06 -0.81,0 93.98,0 93.98,87.06
  pour Bottom (isolate 0.508, rank 2, no thermals): -1.04,88.27 -1.04,0 93.98,0 93.98,87.02
GNDA  (via drill 0.35, 0.64)
  Top 0.254: 40.03,68.47 SV2.1
  Top 0.381: C99.2 26.85,46.99 v25.4,46.99
  Top 0.5: v22.5,59.5 20.48,57.48 20.32,57.48
  Top 0.508: 20.32,57.48 v20.32,54.61 | RESET1.1 28.45,69 | 28.45,69 28.45,67.21 U$5.PB8-BOOT0 U$5.VSS1 | U$5.VSS v38.1,58.24 39.6,56.74 41.28,56.74 LED1.C | U$6.R1-10 34.84,73.66 40.03,68.47 | U$6.R1-2 28.69,84.25 16.92,84.25 R0.1 | v24.13,67.31 24.11,67.33 C16.2 | v30,67.9 28.9,69 28.45,69
  Bottom 0.254: U$14.1 23.15,53.69 22.86,53.69
  Bottom 0.381: v25.4,46.99 25.4,47.69 24.56,48.52
  Bottom 0.406: 22.86,53.69 21.5,53.69 | 24.56,48.52 U$14.9 22.14,48.52 22.09,48.56 | 14.26,51.09 17.41,51.09 | 17.41,51.09 U$14.16 | 19.15,51.09 17.41,51.09 | U$14.20 17.73,53.73 18.18,54.19
  Bottom 0.47: U$14.12 15.09,48.52
  Bottom 0.5: 30.95,63.34 C12.2 | 22.81,59.81 v22.5,59.5 22.25,59.75 16.82,59.75 | C15.2 C14.2 32.68,61.51 C11.2 | 20.32,50.34 19.89,50.34 19.15,51.09 | 19.89,54.19 18.18,54.19
  Bottom 0.508: 16.82,59.75 15.39,61.18 15.39,64.53 C18.2 13.5,66.42 13.5,69.48 C17.2 | C11.2 30.95,63.34 | C12.2 C10.2 31.11,65.11 C13.2 34.52,65.11 36.2,66.8 | v20.32,54.61 21.25,53.69 21.5,53.69 | 22.09,48.56 20.32,50.34 v20.32,54.61 | 14.26,51.09 13.72,50.55 13.72,49.9 15.09,48.52 | v20.32,54.61 19.89,54.19 | 38.41,68.11 38.1,68.11 | 36.2,66.8 37.51,68.11 38.1,68.11 | v38.1,58.24 38.1,68.11 | 22.81,59.81 C15.2 | 36.2,66.8 30.2,66.8 30,67 | 30,67 v30,67.9 | v24.13,67.31 24.44,67 30,67
  Bottom 0.61: SV2.1 40.14,68.11 38.41,68.11
  Bottom 0.813: U$6.R1-1 U$6.R1-6 U$6.R1-7 U$6.R1-8 U$6.R1-9 U$6.R1-10 U$6.R1-5 U$6.R1-4 U$6.R1-3 U$6.R1-2 U$6.R1-1
N$1
  Top 0.305: U$5.PA15 37.28,66.74 39.48,64.54 42.99,64.54 R1.1
N$2
  Top 0.305: LED1.A R1.2
N$3
  Top 0.254: R4.1 20.39,61.57 Y2.2
  Bottom 0.254: Y2.2 16.26,62.08 16.26,65.37 C18.1
N$4
  Top 0.254: R6.1 20.26,66.45 Y2.1
  Bottom 0.254: 16.76,71.05 Y2.1
  Bottom 0.305: C17.1 16.76,71.05
N$5
  Top 0.254: R11.2 5.74,76.01 5.87,76.14 | 5.87,76.14 C5.2 | R10.1 8.23,73.77 5.87,76.14
N$8  (via drill 0.35)
  other vias: 88,60
N$13  (via drill 0.35)
  other vias: 12,54
NRST  (via drill 0.35)
  Top 0.254: v23.24,65.91 19.63,69.53 R5.1 21.9,75.8 27.11,75.8 32.82,70.1 RESET1.2 36.34,70.1 37.47,68.97 | v23.24,62.87 26.64,62.87 U$5.NRST
  Top 0.305: 37.47,68.97 SV2.2 | R5.1 22.41,70.75 C16.1
  Bottom 0.254: v23.24,65.91 v23.24,62.87
OSC_IN
  Top 0.254: U$5.PF0-OSC_IN 22.12,64.49 21.68,64.94 R6.2
OSC_OUT
  Top 0.254: R4.2 22.07,63.21 22.56,63.69 U$5.PF1-OSC_OUT
SWCLK
  Top 0.305: U$5.PA14 37.6,65.29 39.51,63.39 SV2.3
SWDIO
  Top 0.305: U$5.PA13 36.86,64.49 SV2.4
TIM3_CH1
  Top 0.254: U$5.PA6 30.52,55.84 34.1,52.26 34.1,31.48 39.64,25.94 U$7.PWM_SGN
TIM3_CH2
  Top 0.254: U$5.PA7 31.32,56.31 40.1,47.53 U$2.PWM_SGN
TIM3_CH3  (via drill 0.35)
  Top 0.254: U$1.PWM_SGN 85.81,24.13 68.31,24.13 56.88,35.56 v49.53,35.56 | 39.49,49.53 v48.87,49.53 | U$5.PB0 32.12,56.9
  Top 0.305: 32.12,56.9 39.49,49.53
  Bottom 0.254: v48.87,49.53 49.03,49.53 49.03,36.06 v49.53,35.56
TIM3_CH4  (via drill 0.35)
  Top 0.203: v74.3,59.31 74.3,49.7 76,48
  Top 0.254: v49.02,51.31 48.01,50.29 39.88,50.29 32.92,57.25 U$5.PB1 | U$3.PWM_SGN 76.47,47.53 76,48 75,49
  Bottom 0.203: 50.8,59.69 73.91,59.69 v74.3,59.31
  Bottom 0.254: 50.8,59.69 49.02,57.91 v49.02,51.31
VCC1  (via drill 0.64)
  Top 0.254: v41.91,36.36 57.35,36.36 68.31,25.4 74.93,25.4 76.2,26.67 RSH1.1
  Bottom 0.254: U$14.7 23.21,49.81 24.24,49.81 36.81,37.24 41.03,37.24 v41.91,36.36
  pour Top (no thermals): 74.93,30.48 74.93,26.67 85.09,26.67 88.29,29.87 88.29,34.08 78.53,34.08
VCC2
  Bottom 0.254: RSH2.1 37.8,50.73 33.02,55.51 17.41,55.51 16.14,54.24 16.14,52.89 16.61,52.42 U$14.18
  pour Bottom (no thermals): 36.83,48.26 39.37,48.26 40.64,49.53 40.64,51.26 42.26,52.88 42.26,55.63 39.12,55.63 36.83,53.34 36.83,52.07
VCC3  (via drill 0.64)
  Top 0.254: v40.64,45.72 48.26,45.72 50.08,47.54 v50.08,56.79 | v76.43,58.42 77.47,57.38 RSH3.1
  Bottom 0.254: U$14.3 30.12,52.42 36.83,45.72 v40.64,45.72 | v50.08,56.79 51.7,58.42 v76.43,58.42
  pour Top (no thermals): 76.2,55.88 76.2,49.53 90.17,49.53 91.44,50.8 92.71,52.07 92.71,55.88
VCC7
  Bottom 0.203: 38.73,29 38,29 18.79,48.21 18.79,49.35 18.34,49.8 17.47,49.8
  Bottom 0.254: 38.73,29 RSH7.1 | 17.47,49.8 U$14.14
  pour Bottom (no thermals): 36.83,31.75 36.83,27.94 38.1,26.67 40.64,26.67 40.64,29.21 42.59,31.16 42.59,32.34 42.59,34.29 38.1,34.29 38.1,33.02